# Altium schematic sheet MyProSch2.SchDoc
size A
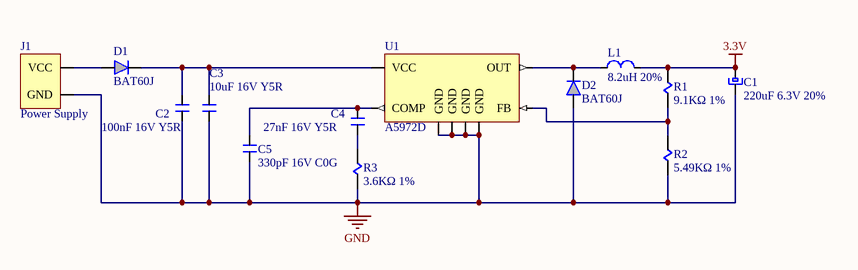
[diagram p0: MyProSch2.SchDoc]

## Parts
C1  220uF 6.3V 20%
C2  100nF 16V Y5R
C3  10uF 16V Y5R
C4  27nF 16V Y5R
C5  330pF 16V C0G
D1  BAT60J
D2  BAT60J
J1  Power Supply
L1  8.2uH 20%
R1  9.1KΩ 1%
R2  5.49KΩ 1%
R3  3.6KΩ 1%
U1  A5972D

## Nets
3.3V: C1.1(P) L1.2(P2) R1.2(P2)
GND: C1.2(N) C2.2(A2) C3.2(A2) C5.2(A2) D2.1(A) J1.2(GND) R2.1(P1) R3.1(P1) U1.2(GND) U1.3(GND) U1.6(GND) U1.7(GND)
NetC2_1: C2.1(A1) C3.1(A1) D1.2(K) U1.8(VCC)
NetC4_1: C4.1(A1) C5.1(A1) U1.4(COMP)
NetC4_2: C4.2(A2) R3.2(P2)
NetD1_1: D1.1(A) J1.1(VCC)
NetD2_2: D2.2(K) L1.1(P1) U1.1(OUT)
NetR1_1: R1.1(P1) R2.2(P2) U1.5(FB)

## Library data of the parts
C1 = Polarized Capacitor
C2-C5 = Capacitor
D1 D2 = Diode: Generic Diode
J1 = Power Connector
L1 = Inductor
R1-R3 = Resistor
U1 = A5972D: Fuente Switching 3.3v 1.5A